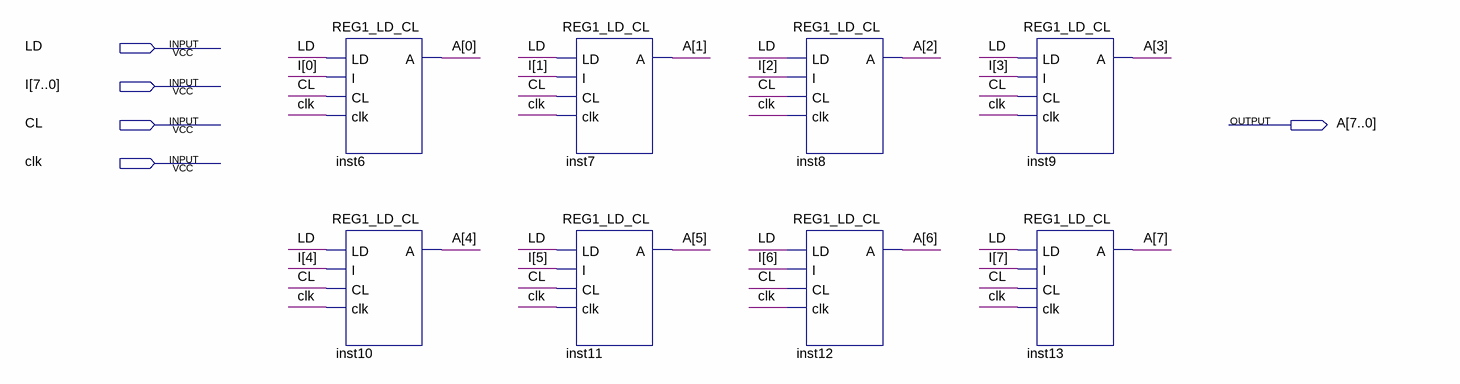
[diagram p0: schematic sheet]
// Quartus schematic REG8_LD_CL.bdf as structural Verilog: 8 symbols, 5 pins
module REG8_LD_CL (
  input  LD,
  input  [7:0] I,
  input  CL,
  input  clk,
  output [7:0] A
);

  REG1_LD_CL inst6 (.LD(LD), .I(I[0]), .CL(CL), .clk(clk), .A(A[0]));
  REG1_LD_CL inst10 (.LD(LD), .I(I[4]), .CL(CL), .clk(clk), .A(A[4]));
  REG1_LD_CL inst7 (.LD(LD), .I(I[1]), .CL(CL), .clk(clk), .A(A[1]));
  REG1_LD_CL inst11 (.LD(LD), .I(I[5]), .CL(CL), .clk(clk), .A(A[5]));
  REG1_LD_CL inst8 (.LD(LD), .I(I[2]), .CL(CL), .clk(clk), .A(A[2]));
  REG1_LD_CL inst12 (.LD(LD), .I(I[6]), .CL(CL), .clk(clk), .A(A[6]));
  REG1_LD_CL inst9 (.LD(LD), .I(I[3]), .CL(CL), .clk(clk), .A(A[3]));
  REG1_LD_CL inst13 (.LD(LD), .I(I[7]), .CL(CL), .clk(clk), .A(A[7]));
endmodule
